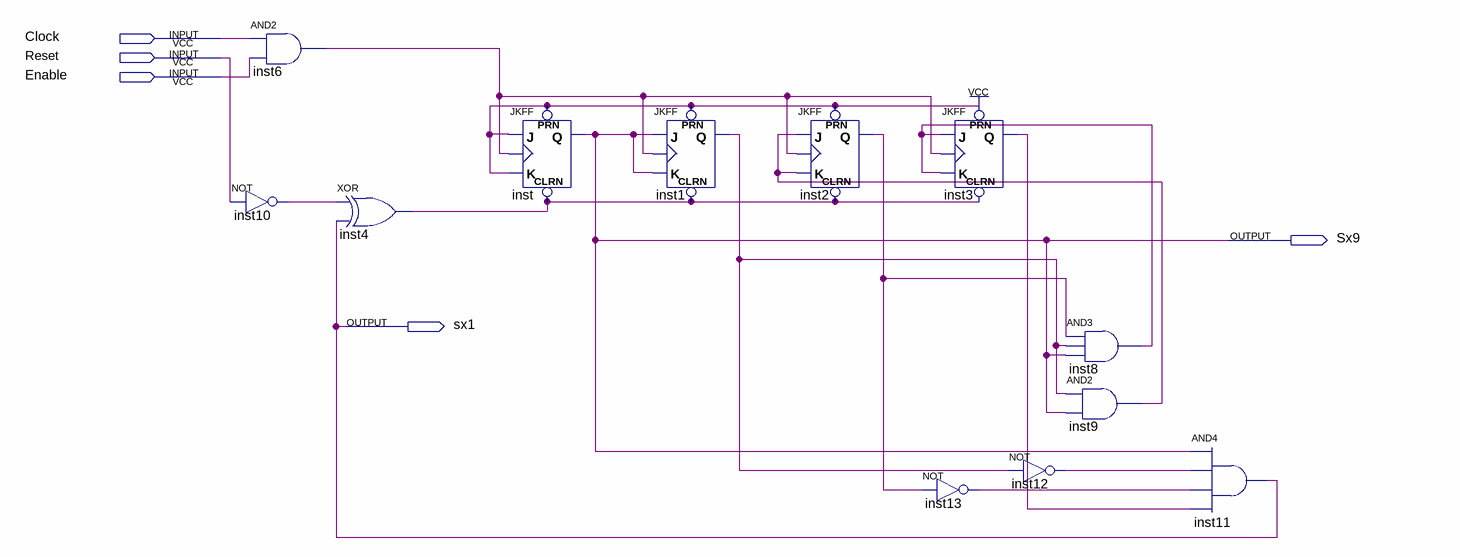
[diagram p0: schematic sheet]
// Quartus schematic Cont_sinc_proj.bdf as structural Verilog: 12 symbols, 5 pins
module Cont_sinc_proj (
  input  Clock,
  input  Reset,
  input  Enable,
  output Sx9,
  output sx1
);

  wire inst1_q, inst2_q, inst3_q, inst4_out, inst6_out, inst8_out, inst9_out, inst10_out, inst12_out,
       inst13_out;

  and inst6 (inst6_out, Clock, Enable);
  not inst10 (inst10_out, Reset);
  xor inst4 (inst4_out, inst10_out, sx1);
  JKFF inst (.PRN(1'b1), .CLRN(inst4_out), .K(1'b1), .J(1'b1), .CLK(inst6_out), .Q(Sx9));
  JKFF inst1 (.PRN(1'b1), .CLRN(inst4_out), .K(Sx9), .J(Sx9), .CLK(inst6_out), .Q(inst1_q));
  JKFF inst2 (.PRN(1'b1), .CLRN(inst4_out), .K(inst9_out), .J(inst9_out), .CLK(inst6_out), .Q(inst2_q));
  JKFF inst3 (.PRN(1'b1), .CLRN(inst4_out), .K(inst8_out), .J(inst8_out), .CLK(inst6_out), .Q(inst3_q));
  not inst13 (inst13_out, inst2_q);
  not inst12 (inst12_out, inst1_q);
  and inst8 (inst8_out, inst2_q, inst1_q, Sx9);
  and inst9 (inst9_out, inst1_q, Sx9);
  and inst11 (sx1, Sx9, inst12_out, inst13_out, inst3_q);
endmodule
